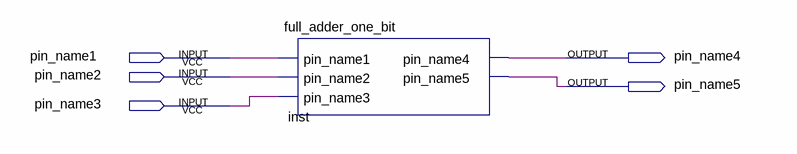
[diagram p0: schematic sheet]
// Quartus schematic ALU.bdf as structural Verilog: 1 symbols, 5 pins
module ALU (
  input  pin_name1,
  input  pin_name2,
  input  pin_name3,
  output pin_name4,
  output pin_name5
);

  full_adder_one_bit inst (
    .pin_name1(pin_name1), .pin_name2(pin_name2), .pin_name3(pin_name3), .pin_name4(pin_name4),
    .pin_name5(pin_name5));
endmodule
